# EAGLE schematic reciver (EAGLE 9.6.2)
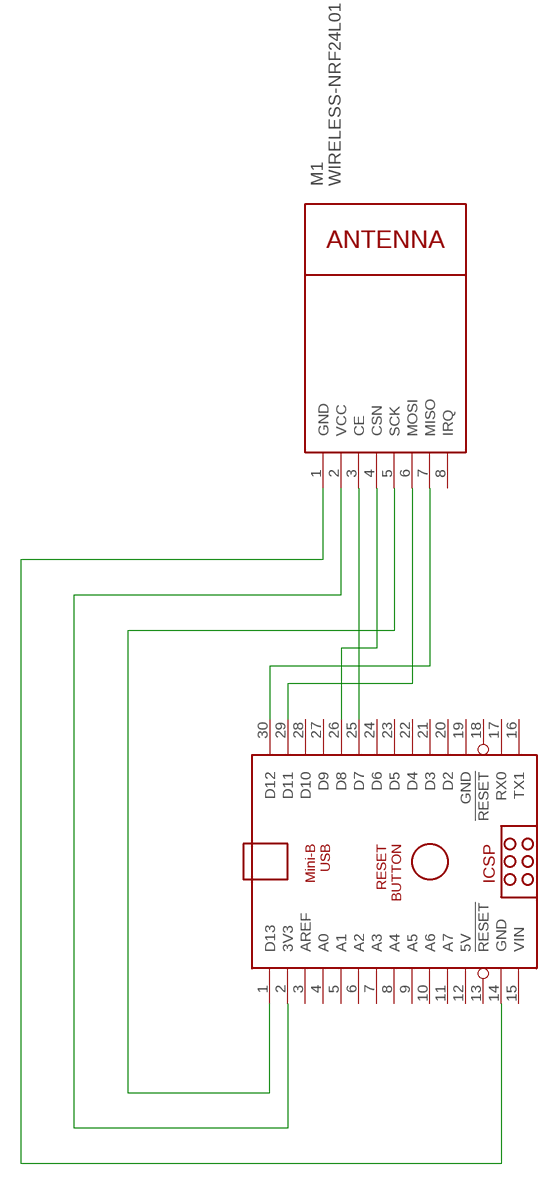
[diagram p0: schematic, sheet 1]

## Parts
ARDUINO_NANO2  ARDUINO_NANO  [ARDUINO_NANO]
M1  WIRELESS-NRF24L01  [WIRELESS-NRF24L01]

## Nets
N$6: ARDUINO_NANO2.2(3V3) M1.2(VCC)
N$7: ARDUINO_NANO2.14(GND) M1.1(GND)
N$8: ARDUINO_NANO2.26(D8) M1.4(CSN)
N$9: ARDUINO_NANO2.25(D7) M1.3(CE)
N$10: ARDUINO_NANO2.1(D13) M1.5(SCK)
N$11: ARDUINO_NANO2.29(D11) M1.6(MOSI)
N$12: ARDUINO_NANO2.30(D12) M1.7(MISO)
Unconnected: ARDUINO_NANO2.3(AREF) ARDUINO_NANO2.4(A0) ARDUINO_NANO2.5(A1) ARDUINO_NANO2.6(A2) ARDUINO_NANO2.7(A3) ARDUINO_NANO2.8(A4) ARDUINO_NANO2.9(A5) ARDUINO_NANO2.10(A6) ARDUINO_NANO2.11(A7) ARDUINO_NANO2.13(!RESET) ARDUINO_NANO2.16(TX1) ARDUINO_NANO2.17(RX0) ARDUINO_NANO2.18(!RESET) ARDUINO_NANO2.20(D2) ARDUINO_NANO2.21(D3) ARDUINO_NANO2.22(D4) ARDUINO_NANO2.23(D5) ARDUINO_NANO2.24(D6) ARDUINO_NANO2.27(D9) ARDUINO_NANO2.28(D10) M1.8(IRQ)

## Power pins joined to a net without a drawn wire
5V: ARDUINO_NANO2.12(5V)
GND: ARDUINO_NANO2.19(GND)
VIN: ARDUINO_NANO2.15(VIN)

## Library data of the parts
ARDUINO_NANO2 = ArduinoNanoV30:ARDUINO_NANO: Arduino Nano V3.0 Overview: The Arduino Nano is a small, complete, and breadboard-friendly board based on the ATmega328 (Arduino Nano 3.x) or ATmega168 (Arduino Nano 2.x). It has more or less the same functionality of the Arduino Duemilanove, but in a different package. It lacks only a DC power jack, and works with a Mini-B USB cable instead of a standard one. The Nano was designed and is being produced by Gravitech. Specifications: Microcontroller Atmel ATmega168 or ATmega328 Operating Voltage (logic level) 5 V Input Voltage (recommended) 7-12 V Input Voltage (limits) 6-20 V Digital I/O Pins 14 (of which 6 provide PWM output) Analog Input Pins 8 DC Current per I/O Pin 40 mA Flash Memory 16 KB (ATmega168) or 32 KB (ATmega328) of which 2 KB used by bootloader SRAM 1 KB (ATmega168) or 2 KB (ATmega328) EEPROM 512 bytes (ATmega168) or 1 KB (ATmega328) Clock Speed 16 MHz Dimensions 0.73" x 1.70" Length 45 mm Width 18 mm Weigth 5 g Power: The Arduino Nano can be powered via the Mini-B USB connection, 6-20V unregulated external power supply (pin 30), or 5V regulated external power supply (pin 27). The power source is automatically selected to the highest voltage source. Memory: The ATmega168 has 16 KB of flash memory for storing code (of which 2 KB is used for the bootloader); the ATmega328 has 32 KB, (also with 2 KB used for the bootloader). The ATmega168 has 1 KB of SRAM and 512 bytes of EEPROM (which can be read and written with the EEPROM library); the ATmega328 has 2 KB of SRAM and 1 KB of EEPROM. Input and Output: Each of the 14 digital pins on the Nano can be used as an input or output, using pinMode(), digitalWrite(), and digitalRead() functions. They operate at 5 volts. Each pin can provide or receive a maximum of 40 mA and has an internal pull-up resistor (disconnected by default) of 20-50 kOhms. In addition, some pins have specialized functions. Visit Arduino - ArduinoBoardNano <https://www.arduino.cc/en/Main/ArduinoBoardNano>
M1 = diy-modules:WIRELESS-NRF24L01: 2.4 GHz Wireless Module based on NRF24L01 chip More details available here: http://www.electrodragon.com/w/NRF24L01 Click here to find device on ebay.com <http://www.ebay.com/sch/nrf24l01+arduino>